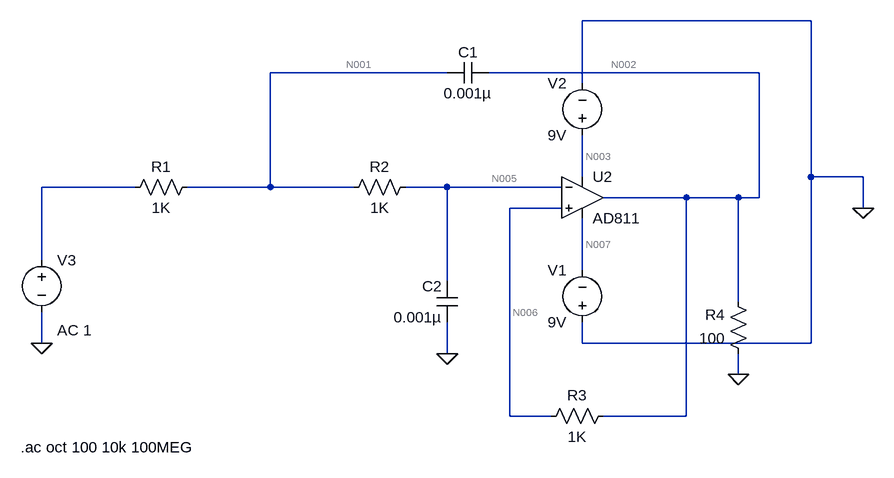
[diagram p0: schematic Симуляція.asc]
Симуляція.asc, the LTspice schematic file:
Version 4
SHEET 1 880 680
WIRE 496 -160 144 -160
WIRE -64 -80 -336 -80
WIRE 416 -80 0 -80
WIRE 144 -64 144 -160
WIRE 144 80 144 16
WIRE 496 80 496 -160
WIRE 576 80 496 80
WIRE -544 96 -688 96
WIRE -336 96 -336 -80
WIRE -336 96 -464 96
WIRE -208 96 -336 96
WIRE -64 96 -128 96
WIRE 112 96 -64 96
WIRE 304 112 176 112
WIRE 384 112 304 112
WIRE 416 112 416 -80
WIRE 416 112 384 112
WIRE 112 128 32 128
WIRE 576 128 576 80
WIRE -688 208 -688 96
WIRE 144 224 144 144
WIRE -64 240 -64 96
WIRE 384 272 384 112
WIRE -688 336 -688 288
WIRE 144 336 144 304
WIRE 496 336 496 80
WIRE 496 336 144 336
WIRE -64 352 -64 304
WIRE 384 384 384 352
WIRE 32 448 32 128
WIRE 96 448 32 448
WIRE 304 448 304 112
WIRE 304 448 176 448
FLAG -64 352 0
FLAG 384 384 0
FLAG 576 128 0
FLAG -688 336 0
SYMBOL res -448 80 R90
WINDOW 0 0 56 VBottom 2
WINDOW 3 32 56 VTop 2
SYMATTR InstName R1
SYMATTR Value 1K
SYMATTR SpiceLine tol=1 pwr=0.1
SYMBOL res -112 80 R90
WINDOW 0 0 56 VBottom 2
WINDOW 3 32 56 VTop 2
SYMATTR InstName R2
SYMATTR Value 1K
SYMATTR SpiceLine tol=1 pwr=0.1
SYMBOL res 192 432 R90
WINDOW 0 0 56 VBottom 2
WINDOW 3 32 56 VTop 2
SYMATTR InstName R3
SYMATTR Value 1K
SYMATTR SpiceLine tol=1 pwr=0.1
SYMBOL res 400 368 R180
WINDOW 0 36 76 Left 2
WINDOW 3 36 40 Left 2
SYMATTR InstName R4
SYMATTR Value 100
SYMATTR SpiceLine tol=1 pwr=0.1
SYMBOL cap 0 -96 R90
WINDOW 0 0 32 VBottom 2
WINDOW 3 32 32 VTop 2
SYMATTR InstName C1
SYMATTR Value 0.001µ
SYMATTR SpiceLine V=6.3 Irms=25.7m Rser=3.62516 Lser=0 mfg="KEMET" pn="C0402C102K9RAC" type="X7R"
SYMBOL cap -48 304 R180
WINDOW 0 24 56 Left 2
WINDOW 3 24 8 Left 2
SYMATTR InstName C2
SYMATTR Value 0.001µ
SYMATTR SpiceLine V=6.3 Irms=25.7m Rser=3.62516 Lser=0 mfg="KEMET" pn="C0402C102K9RAC" type="X7R"
SYMBOL voltage 144 320 R180
WINDOW 0 24 96 Left 2
WINDOW 3 24 16 Left 2
SYMATTR InstName V1
SYMATTR Value 9V
SYMBOL voltage 144 32 R180
WINDOW 0 24 96 Left 2
WINDOW 3 24 16 Left 2
SYMATTR InstName V2
SYMATTR Value 9V
SYMBOL voltage -688 192 R0
WINDOW 123 24 124 Left 2
WINDOW 39 0 0 Left 0
SYMATTR Value2 AC 1
SYMATTR InstName V3
SYMATTR Value ""
SYMBOL Opamps\\AD811 144 48 R0
SYMATTR InstName U2
TEXT -720 496 Left 2 !.ac oct 100 10k 100MEG

The netlist it stands for:
* Симуляція.asc
R1 N001 N004 1K tol=1 pwr=0.1
R2 N005 N001 1K tol=1 pwr=0.1
R3 N002 N006 1K tol=1 pwr=0.1
R4 0 N002 100 tol=1 pwr=0.1
C1 N002 N001 0.001µ V=6.3 Irms=25.7m Rser=3.62516 Lser=0 mfg="KEMET" pn="C0402C102K9RAC" type="X7R"
C2 0 N005 0.001µ V=6.3 Irms=25.7m Rser=3.62516 Lser=0 mfg="KEMET" pn="C0402C102K9RAC" type="X7R"
V1 0 N007 9V
V2 N003 0 9V
V3 N004 0 AC 1
XU2 N006 N005 N003 N007 N002 AD811  ; pins In+ In- V+ V- OUT
.ac oct 100 10k 100MEG
.backanno
.end

* Results of the author's LTspice run, read from the files saved beside the schematic
* Operating Point, zero values left out:
*   V(n001) = 2.005 mV
*   V(n005) = 4.009 mV
*   V(n002) = 1.506 mV
*   V(n006) = 3.509 mV
*   V(n007) = -9 V
*   V(n003) = 9 V
*   I(R4) = -15.06 µA
*   I(R3) = -2.004 µA
*   I(R2) = 2.005 µA
*   I(R1) = 2.005 µA
*   I(V3) = 2.005 µA
*   I(V2) = -17.14 mA
*   I(V1) = -17.12 mA
*   Ix(u2:1) = -2.004 µA
*   Ix(u2:2) = -2.005 µA
*   Ix(u2:99) = 17.14 mA
*   Ix(u2:50) = -17.12 mA
*   Ix(u2:28) = -13.05 µA
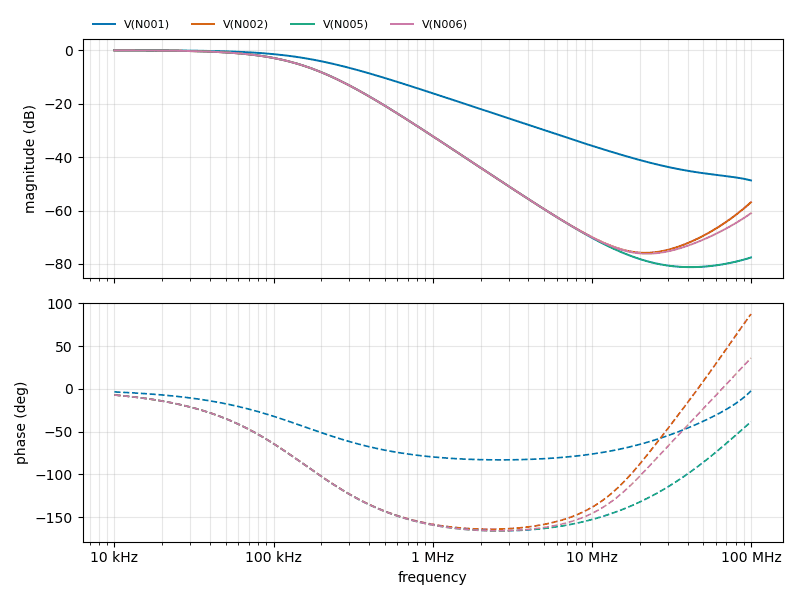
[diagram p1: AC Analysis of Симуляція.asc, plotted from the saved traces]
* AC Analysis, 1 run:
*   V(N001): -0.00 dB at 10 kHz, -48.72 dB at 100 MHz, peak -0.00 dB at 10 kHz, 3 dB below the peak at 159 kHz
*   V(N002): -0.01 dB at 10 kHz, -56.89 dB at 100 MHz, peak -0.01 dB at 10 kHz, 3 dB below the peak at 102.7 kHz
*   V(N005): -0.00 dB at 10 kHz, -77.56 dB at 100 MHz, peak -0.00 dB at 10 kHz, 3 dB below the peak at 102.7 kHz
*   V(N006): -0.00 dB at 10 kHz, -61.00 dB at 100 MHz, peak -0.00 dB at 10 kHz, 3 dB below the peak at 102.7 kHz